# EAGLE schematic untitled (EAGLE 9.0.1)
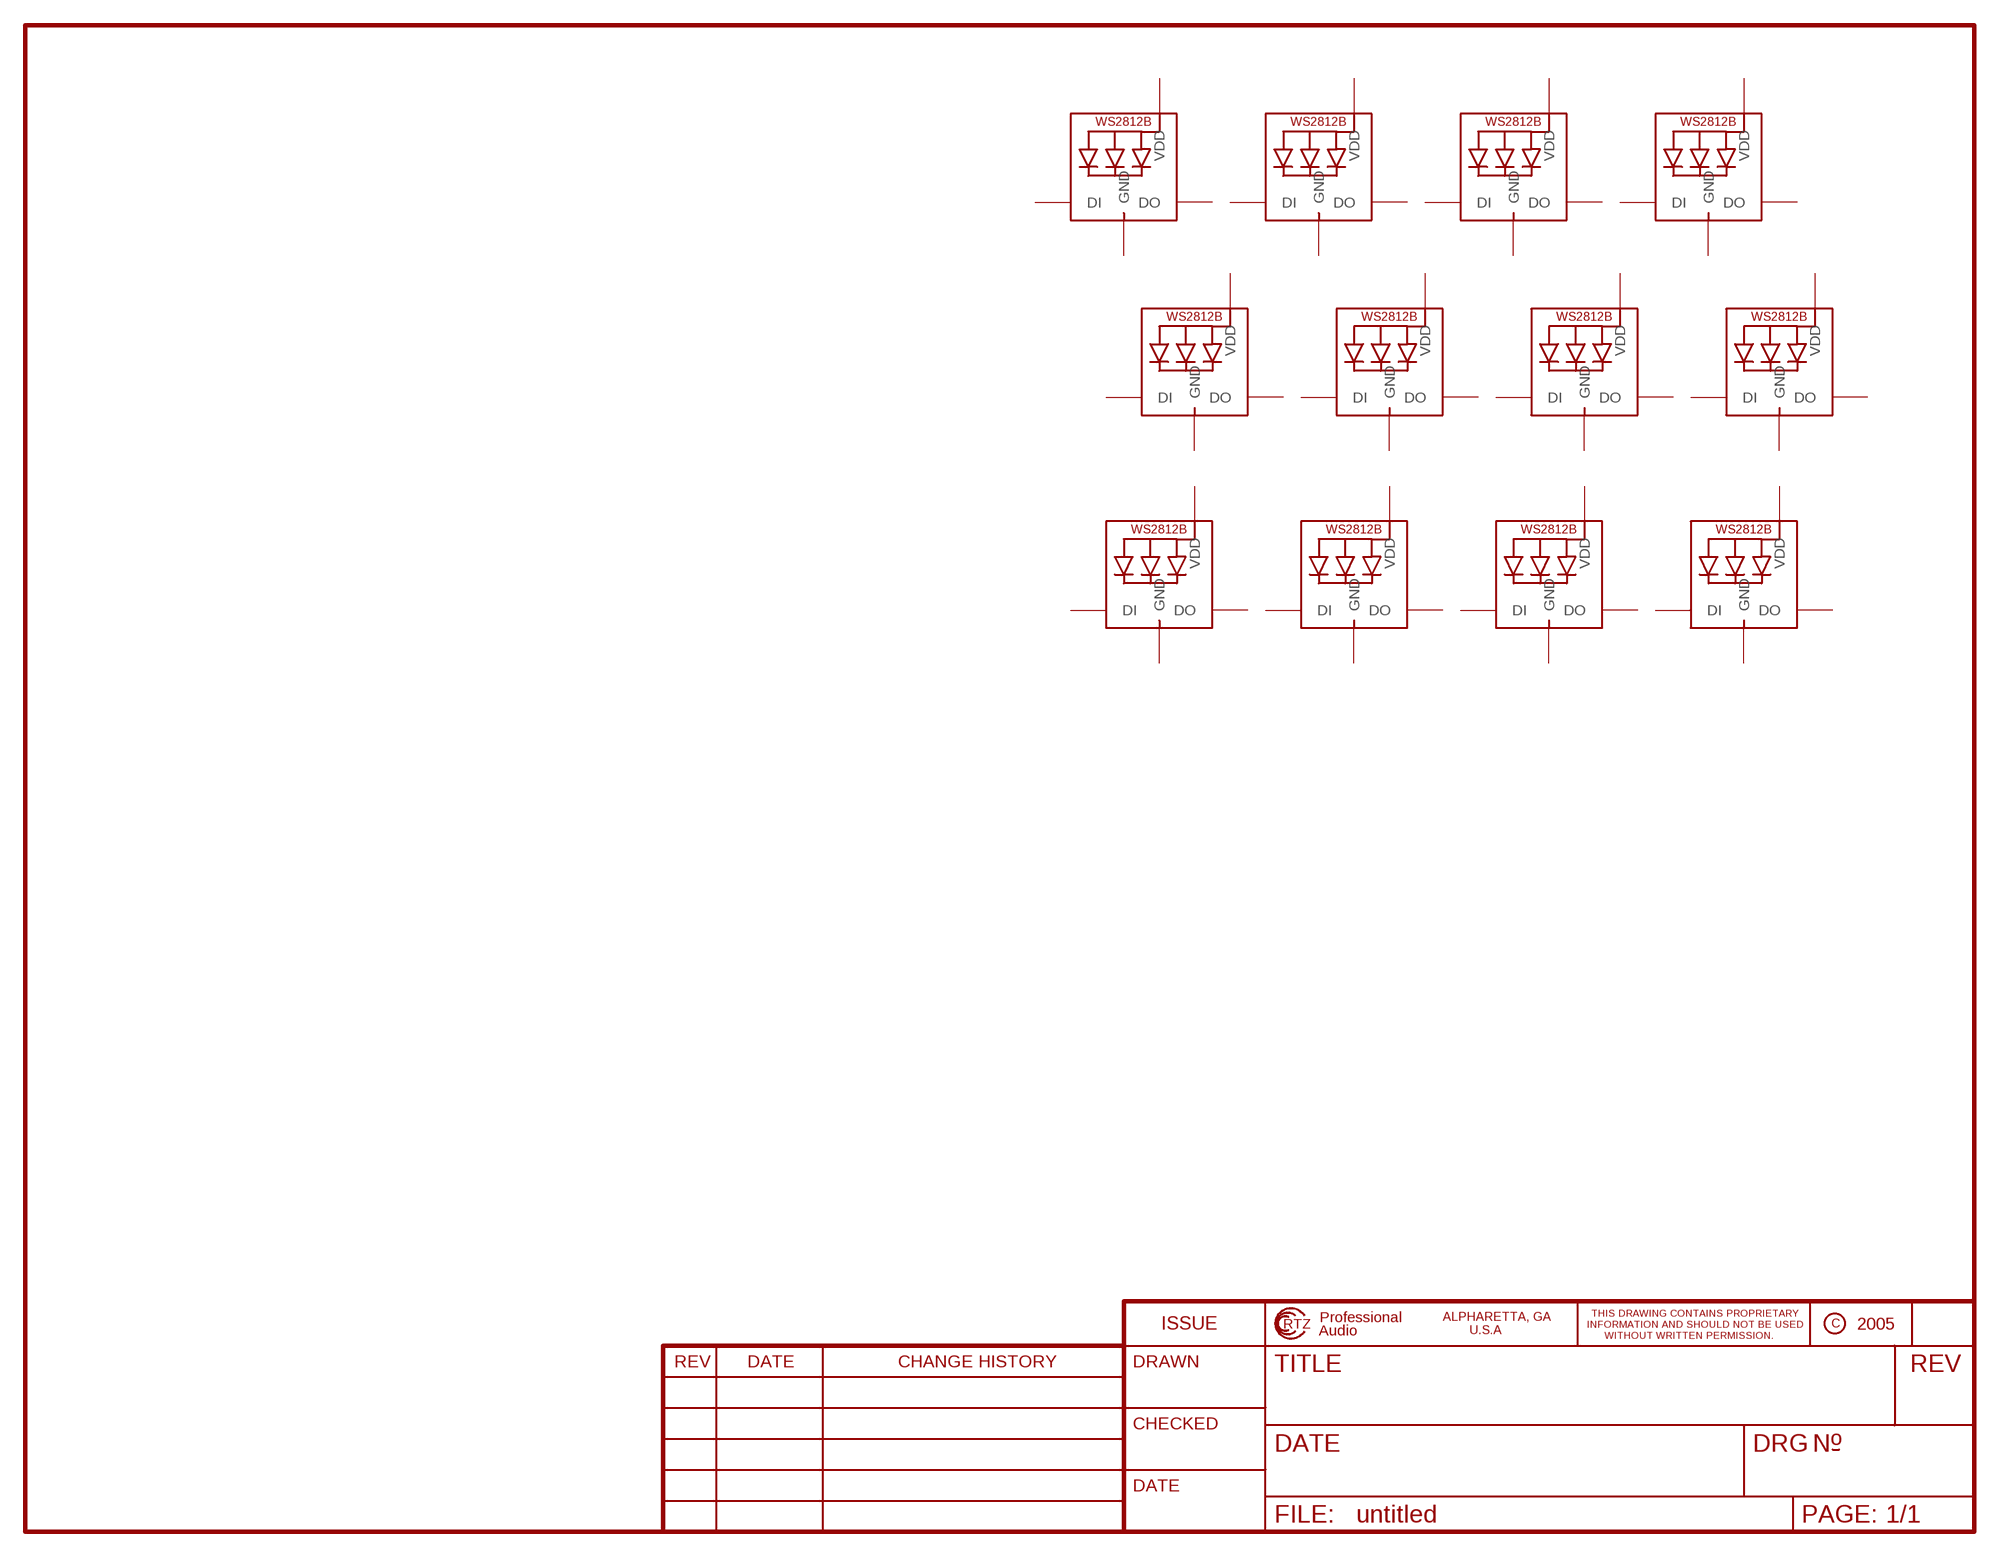
[diagram p0: schematic, sheet 1, part 1 of 2]
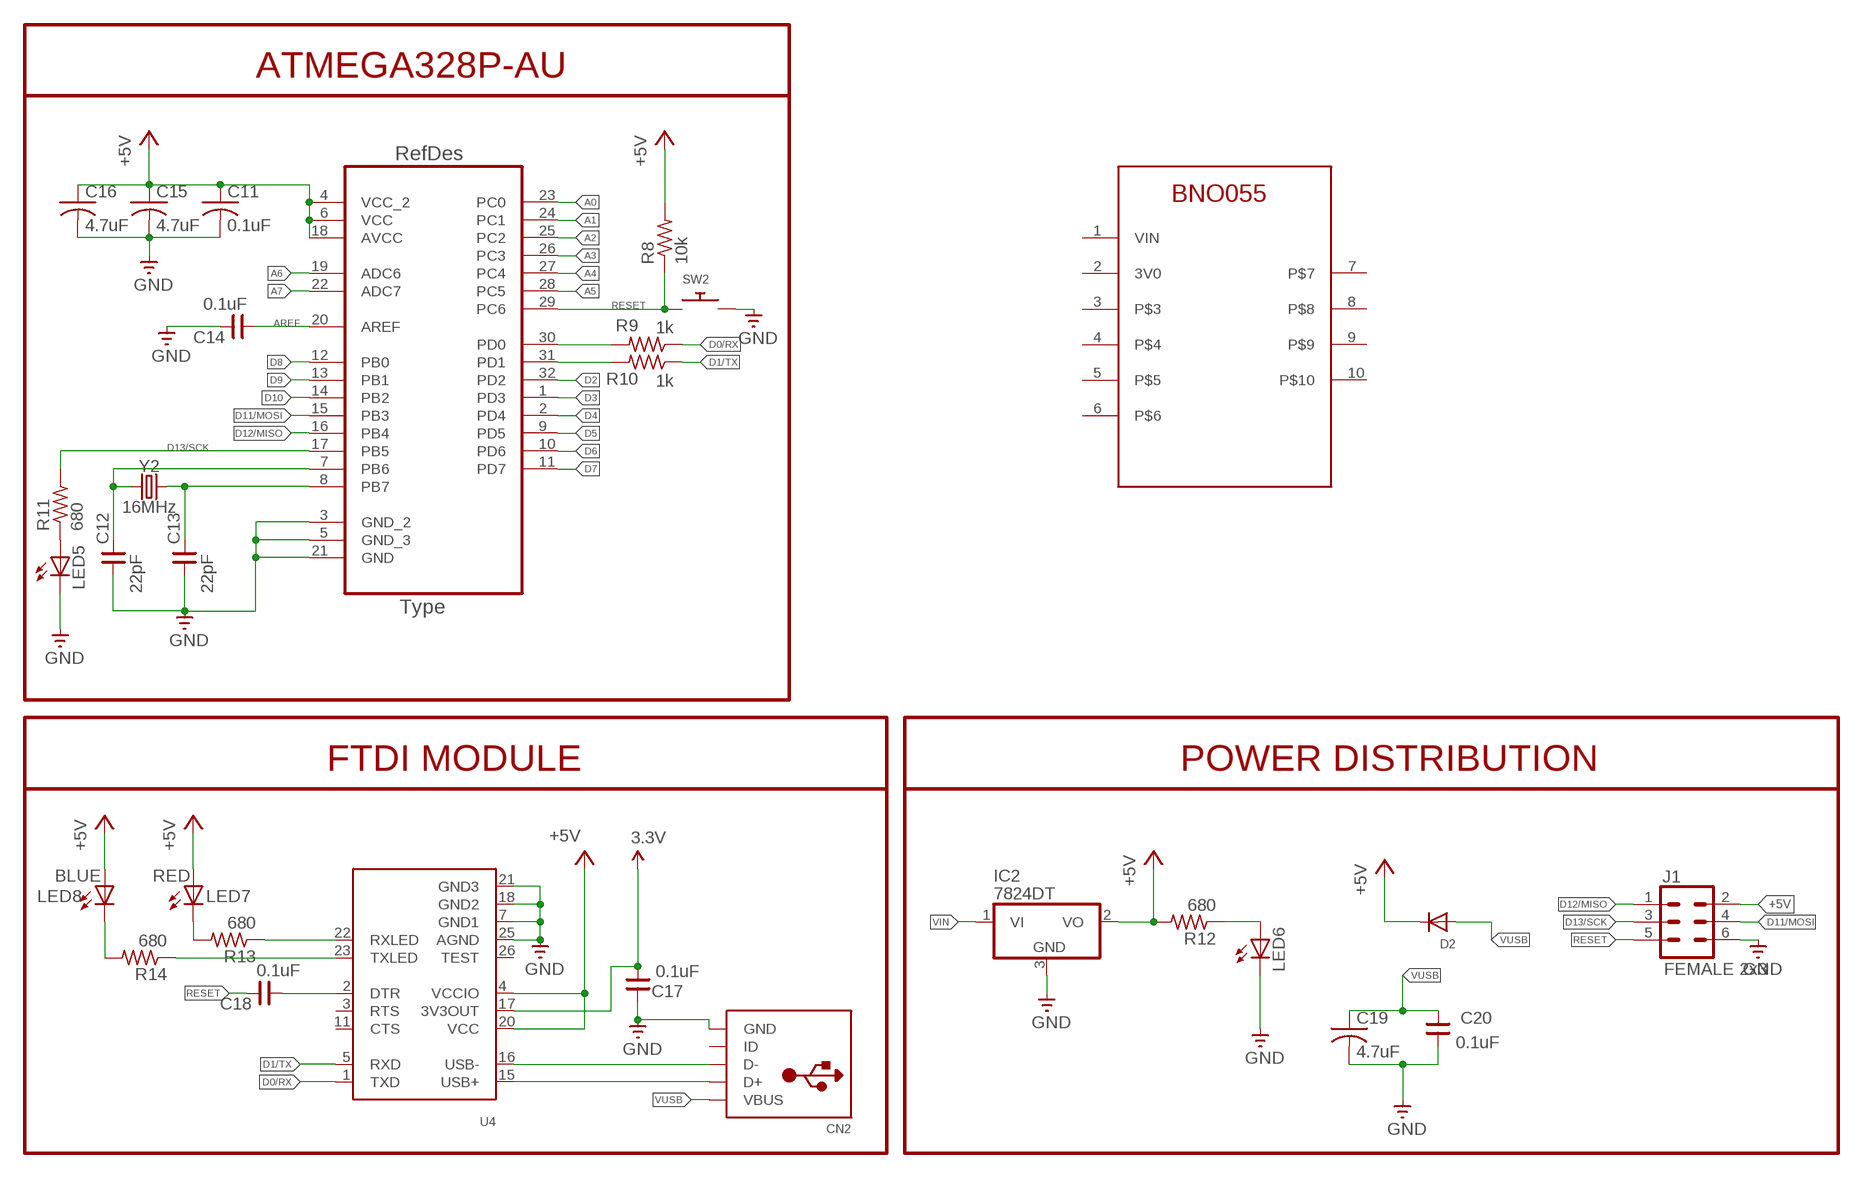
[diagram p1: schematic, sheet 1, part 2 of 2]

## Parts
C11  0.1uF  C-USC0805  [C0805]
C12  22pF  CNP-0805  [0805]
C13  22pF  CNP-0805  [0805]
C14  0.1uF  CNP-0805  [0805]
C15  4.7uF  C-USC0805  [C0805]
C16  4.7uF  C-USC0805  [C0805]
C17  0.1uF  CNP-0805  [0805]
C18  0.1uF  CNP-0805  [0805]
C19  4.7uF  C-USC0805  [C0805]
C20  0.1uF  CNP-0805  [0805]
CN2  USBMINIB  [USB-MINIB]
D2  DIODESOD-123  [SOD-123]
IC2  7824DT  [TO252]
J1  FEMALE 2x3  CONN_03X2FEMALE  [2X3]
LED1  WS2812B5050  [WS2812B]
LED2  WS2812B5050  [WS2812B]
LED3  WS2812B5050  [WS2812B]
LED4  WS2812B5050  [WS2812B]
LED5  LEDCHIPLED_0805  [CHIPLED_0805]
LED6  LEDCHIPLED_0805  [CHIPLED_0805]
LED7  RED  LEDCHIPLED_0805  [CHIPLED_0805]
LED8  BLUE  LEDCHIPLED_0805  [CHIPLED_0805]
LED9  WS2812B5050  [WS2812B]
LED10  WS2812B5050  [WS2812B]
LED11  WS2812B5050  [WS2812B]
LED12  WS2812B5050  [WS2812B]
LED13  WS2812B5050  [WS2812B]
LED14  WS2812B5050  [WS2812B]
LED15  WS2812B5050  [WS2812B]
LED16  WS2812B5050  [WS2812B]
R8  10k  R-US_R0805  [R0805]
R9  1k  R-US_R0805  [R0805]
R10  1k  R-US_R0805  [R0805]
R11  680  R-US_R0805  [R0805]
R12  680  R-US_R0805  [R0805]
R13  680  R-US_R0805  [R0805]
R14  680  R-US_R0805  [R0805]
SW2  SWITCH_PUSHBUTTONEVQ-PE  [TACT_PANA-EVQ]
U3  ATMEGA328P-AU  [QFP80P900X900X120-32N]
U4  FT232RLSSOP28  [SSOP28DB]
U$1  BNO055  [BNO055_SHEILD]
Y2  16MHz  CRYSTAL-16MHZPTH-HC49US  [HC49US]

## Nets
3.3V: C17.2 U4.17(3V3OUT)
+5V: C11.1 C15.1 C16.1 D2.C IC2.2(VO) J1.2 LED7.A LED8.A R8.2 R12.2 U3.4(VCC_2) U3.6(VCC) U3.18(AVCC) U4.4(VCCIO) U4.20(VCC)
A0: U3.23(PC0)
A1: U3.24(PC1)
A2: U3.25(PC2)
A3: U3.26(PC3)
A4: U3.27(PC4)
A5: U3.28(PC5)
A6: U3.19(ADC6)
A7: U3.22(ADC7)
AREF: C14.1 U3.20(AREF)
D0/RX: R9.1 U4.1(TXD)
D1/TX: R10.1 U4.5(RXD)
D2: U3.32(PD2)
D3: U3.1(PD3)
D4: U3.2(PD4)
D5: U3.9(PD5)
D6: U3.10(PD6)
D7: U3.11(PD7)
D8: U3.12(PB0)
D9: U3.13(PB1)
D10: U3.14(PB2)
D11/MOSI: J1.4 U3.15(PB3)
D12/MISO: J1.1 U3.16(PB4)
D13/SCK: J1.3 R11.2 U3.17(PB5)
GND: C11.2 C12.1 C13.1 C14.2 C15.2 C16.2 C17.1 C19.2 C20.1 CN2.GND IC2.3(GND) J1.6 LED5.C LED6.C SW2.P$2 U3.3(GND_2) U3.5(GND_3) U3.21(GND) U4.7(GND1) U4.18(GND2) U4.21(GND3) U4.25(AGND)
N$1: LED5.A R11.1
N$10: C13.2 U3.8(PB7) Y2.2
N$11: C12.2 U3.7(PB6) Y2.1
N$16: R9.2 U3.30(PD0)
N$17: R10.2 U3.31(PD1)
N$19: LED6.A R12.1
N$20: CN2.D+ U4.15(USB+)
N$21: CN2.D- U4.16(USB-)
N$22: R13.1 U4.22(RXLED)
N$23: R14.1 U4.23(TXLED)
N$24: LED8.C R14.2
N$25: LED7.C R13.2
N$26: C18.1 U4.2(DTR)
RESET: C18.2 J1.5 R8.1 SW2.P$1 U3.29(PC6)
VIN: IC2.1(VI)
VUSB: C19.1 C20.2 CN2.VBUS D2.A
Unconnected: CN2.ID LED1.2-DOUT(DO) LED1.4-DIN(DI) LED2.2-DOUT(DO) LED2.4-DIN(DI) LED3.2-DOUT(DO) LED3.4-DIN(DI) LED4.2-DOUT(DO) LED4.4-DIN(DI) LED9.2-DOUT(DO) LED9.4-DIN(DI) LED10.2-DOUT(DO) LED10.4-DIN(DI) LED11.2-DOUT(DO) LED11.4-DIN(DI) LED12.2-DOUT(DO) LED12.4-DIN(DI) LED13.2-DOUT(DO) LED13.4-DIN(DI) LED14.2-DOUT(DO) LED14.4-DIN(DI) LED15.2-DOUT(DO) LED15.4-DIN(DI) LED16.2-DOUT(DO) LED16.4-DIN(DI) U4.3(RTS) U4.11(CTS) U4.26(TEST) U$1.1(VIN) U$1.2(3V0) U$1.3 U$1.4 U$1.5 U$1.6 U$1.7 U$1.8 U$1.9 U$1.10

## Notes on the sheet
- ATMEGA328P-AU
- FTDI MODULE | POWER DISTRIBUTION

## Power pins joined to a net without a drawn wire
GND: LED1.3-GND(GND) LED2.3-GND(GND) LED3.3-GND(GND) LED4.3-GND(GND) LED9.3-GND(GND) LED10.3-GND(GND) LED11.3-GND(GND) LED12.3-GND(GND) LED13.3-GND(GND) LED14.3-GND(GND) LED15.3-GND(GND) LED16.3-GND(GND)
VDD: LED1.1-VDD(VDD) LED2.1-VDD(VDD) LED3.1-VDD(VDD) LED4.1-VDD(VDD) LED9.1-VDD(VDD) LED10.1-VDD(VDD) LED11.1-VDD(VDD) LED12.1-VDD(VDD) LED13.1-VDD(VDD) LED14.1-VDD(VDD) LED15.1-VDD(VDD) LED16.1-VDD(VDD)

## Library data of the parts
C11 C15 C16 C19 = adafruit:C-US: CAPACITOR, American symbol
C12-C14 C17 C18 C20 = cap-master:CNP-: NON-POLARIZED CAP
CN2 = adafruit:USB: USB Connectors USBMINIB - Surface Mount Female Mini-B USB Connector 4UConnector: 06564 By microbuilder.eu Thru-hole RA Female Mini-B USB Connector 4UConnector: 18732 By ladyada.net
D2 = adafruit:DIODE: Diode SMADIODE - SMA Surface Mount Package 20V 1A Schottky Diode Digikey: 641-1014-6-ND DO-1N4148 - Through Hole Small Current Diode SOD-123 20V 1 A (.5mV Vf) Schottky Diode - Digikey: MBRX120TPMSCT-ND SOD-323 10V 570mA (.38mV Vf, 3ns) Schottky Diode - Digikey: ZLLS410CT-ND SOD-523 30V 30mA Schottky Diode (RB751S-40TE61) - Digikey: RB751S-40TE61CT-ND SOT23-R/W - SOT23 Package (R = Solder Paste/Reflow Ovens, W = Hand-Soldering) BAT54Film 40V 300mA - Digikey: 497-7162-1-ND
IC2 = adafruit:78*: Positive VOLTAGE REGULATOR Added bigger pads to the TO-92 package
J1 = SparkFun-Connectors:CONN_03X2: Multi connection point. Often used as Generic Header-pin footprint for 0.1 inch spaced/style header connections You can populate with any combo of single row headers, but if you'd like an exact match, check these: Header - 2x3 (Male, 0.1") <https://www.sparkfun.com/products/12807> (PRT-12807) Header - 2x3 (Female, 0.1") <https://www.sparkfun.com/products/13010> (PRT-13010) 2x3 Pin Shrouded Header <https://www.sparkfun.com/products/10877> (PRT-10877) On any of the 0.1 inch spaced packages, you can populate with these: Break Away Headers - Straight <https://www.sparkfun.com/products/116> (PRT-00116) Break Away Male Headers - Right Angle <https://www.sparkfun.com/products/553> (PRT-00553) Female Headers <https://www.sparkfun.com/products/115> (PRT-00115) Break Away Headers - Machine Pin <https://www.sparkfun.com/products/117> (PRT-00117) Break Away Female Headers - Swiss Machine Pin <https://www.sparkfun.com/products/743> (PRT-00743) Special note: the shrouded connector mates well with our 3x2 ribbon cables: Ribbon Crimp Connector - 6-pin (2x3, Female) <https://www.sparkfun.com/products/10651> (PRT-10651) Ribbon Cable - 6 wire (15ft) <https://www.sparkfun.com/products/10646> (PRT-10646); PROD_ID: CONN-11566
LED1-LED4 LED9-LED16 = adafruit:WS2812B
LED5-LED8 = adafruit:LED: LED OSRAM: - CHIPLED LG R971, LG N971, LY N971, LG Q971, LY Q971, LO R971, LY R971 LH N974, LH R974 LS Q976, LO Q976, LY Q976 LO Q996 - Hyper CHIPLED LW Q18S LB Q993, LB Q99A, LB R99A - SideLED LS A670, LO A670, LY A670, LG A670, LP A670 LB A673, LV A673, LT A673, LW A673 LH A674 LY A675 LS A676, LA A676, LO A676, LY A676, LW A676 LS A679, LY A679, LG A679 - Hyper Micro SIDELED® LS Y876, LA Y876, LO Y876, LY Y876 LT Y87S - SmartLED LW L88C, LW L88S LB L89C, LB L89S, LG L890 LS L89K, LO L89K, LY L89K LS L896, LA L896, LO L896, LY L896 - TOPLED LS T670, LO T670, LY T670, LG T670, LP T670 LSG T670, LSP T670, LSY T670, LOP T670, LYG T670 LG T671, LOG T671, LSG T671 LB T673, LV T673, LT T673, LW T673 LH T674 LS T676, LA T676, LO T676, LY T676, LB T676, LH T676, LSB T676, LW T676 LB T67C, LV T67C, LT T67C, LS T67K, LO T67K, LY T67K, LW E67C LS E67B, LA E67B, LO E67B, LY E67B, LB E67C, LV E67C, LT E67C LW T67C LS T679, LY T679, LG T679 LS T770, LO T770, LY T770, LG T770, LP T770 LB T773, LV T773, LT T773, LW T773 LH T774 LS E675, LA E675, LY E675, LS T675 LS T776, LA T776, LO T776, LY T776, LB T776 LHGB T686 LT T68C, LB T68C - Hyper Mini TOPLED® LB M676 - Mini TOPLED Santana® LG M470 LS M47K, LO M47K, LY M47K Source: http://www.osram.convergy.de/
R8-R14 = adafruit:R-US_: RESISTOR, American symbol
SW2 = adafruit:SWITCH_PUSHBUTTON: Buttons SOFTTOUCHSMD_SJ - Soft touch temporary push button (Super Junk Akihabara) Compatible with SKPMANE010 [Mouser: 688-SKPMAN] C&K_KSS = Digikey: KSS221GLFS
U3 = Atmel-ATMEGA328P-AU:ATMEGA328P-AU; DESCRIPTION: 8-bit Microcontroller with In-System Programmable Flash; MPN: ATMEGA328P-AU; OC_FARNELL: 1715486; OC_NEWARK: 14R4631; PACKAGE: TQFP-32; SUPPLIER: Atmel
U4 = microbuilder:FT232RL: FTDI FT232RL USB TO RS232 Converter Digikey: 768-1007-1-ND
U$1 = shawnmessup:BNO055
Y2 = SparkFun-Clocks:CRYSTAL-16MHZ: 16MHz Crystal Digikey Example <http://www.digikey.com/product-search/en?keywords=535-9122-1-ND> Frequency: 16MHz Frequency Stability: ±50ppm Frequency Tolerance: ±20ppm Load Capacitance: 18pF SparkFun Products: Pro Micro -5V/16MHz <https://www.sparkfun.com/products/12640> SparkFun Serial Enabled LCD Kit <https://www.sparkfun.com/products/10097>; PROD_ID: XTAL-08181; SF_ID: COM-00536